# EAGLE design mikrofonverstärker (EAGLE 5.10)
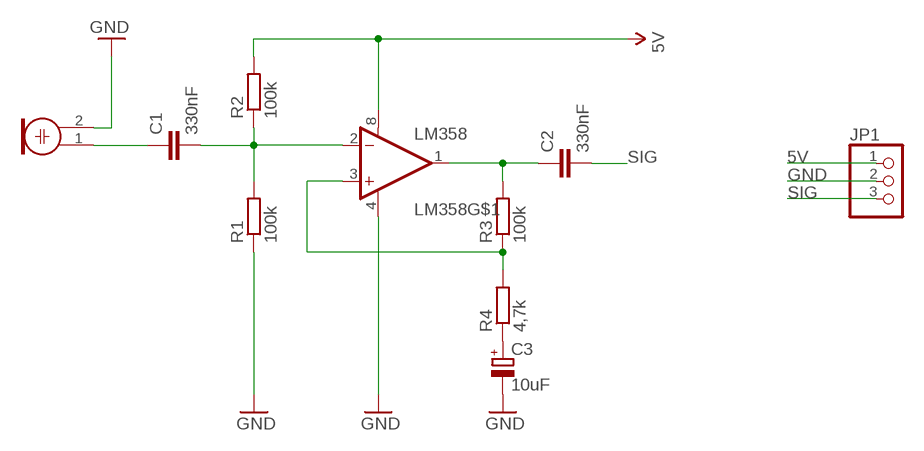
[diagram p0: schematic, sheet 1]

## Parts
C1  330nF  C-EUC0805  [C0805]
C2  330nF  C-EUC0805  [C0805]
C3  10uF  CPOL-EUE2,5-6E  [E2,5-6E]
JP1  PINHD-1X3/90  [1X03/90]
LM358  LM358  [DIP08]
M1  MIC  ELECTRET_MICROPHON-WM-63PR  [WM-63PR]
R1  100k  R-EU_R0805  [R0805]
R2  100k  R-EU_R0805  [R0805]
R3  100k  R-EU_R0805  [R0805]
R4  4,7k  R-EU_R0805  [R0805]

## Nets
5V: JP1.1 LM358.8(V+) R2.2
GND: C3.- JP1.2 LM358.4(V-) M1.2 R1.1
N$1: C2.1 LM358.1(OUT) R3.2
N$2: LM358.3(+IN) R3.1 R4.2
N$3: C1.2 LM358.2(-IN) R1.2 R2.1
N$4: C1.1 M1.1
N$5: C3.+ R4.1
SIG: C2.2 JP1.3
Unconnected: LM358.5(+IN) LM358.6(-IN) LM358.7(OUT)

## Library data of the parts
C1 C2 = rcl:C-EU: CAPACITOR, European symbol
C3 = rcl:CPOL-EU: POLARIZED CAPACITOR, European symbol
JP1 = pinhead:PINHD-1X3: PIN HEADER
LM358 = SparkFun:LM358
M1 = microphon:ELECTRET_MICROPHON-: Electret Condenser Microphone
R1-R4 = rcl:R-EU_: RESISTOR, European symbol

## Board
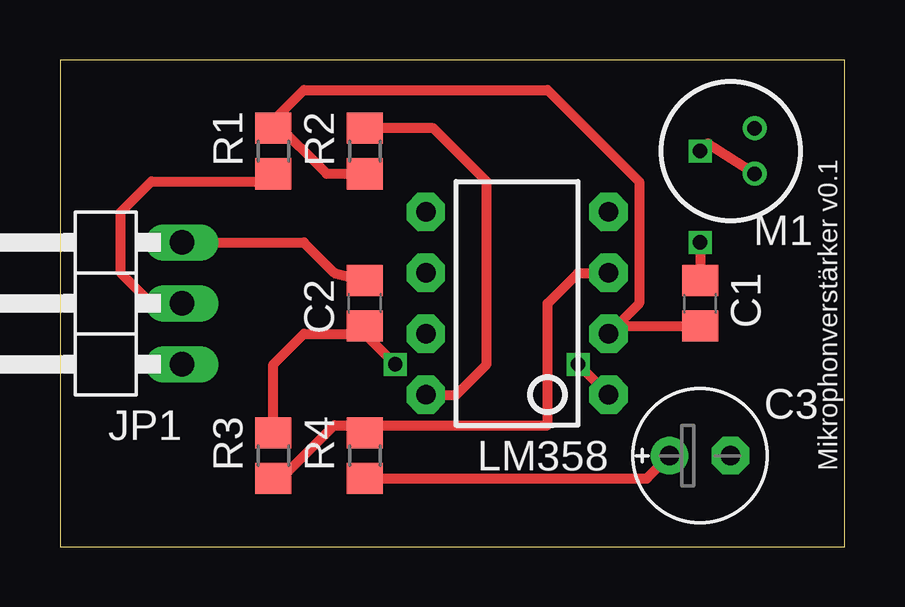
[diagram p1: board, top side]
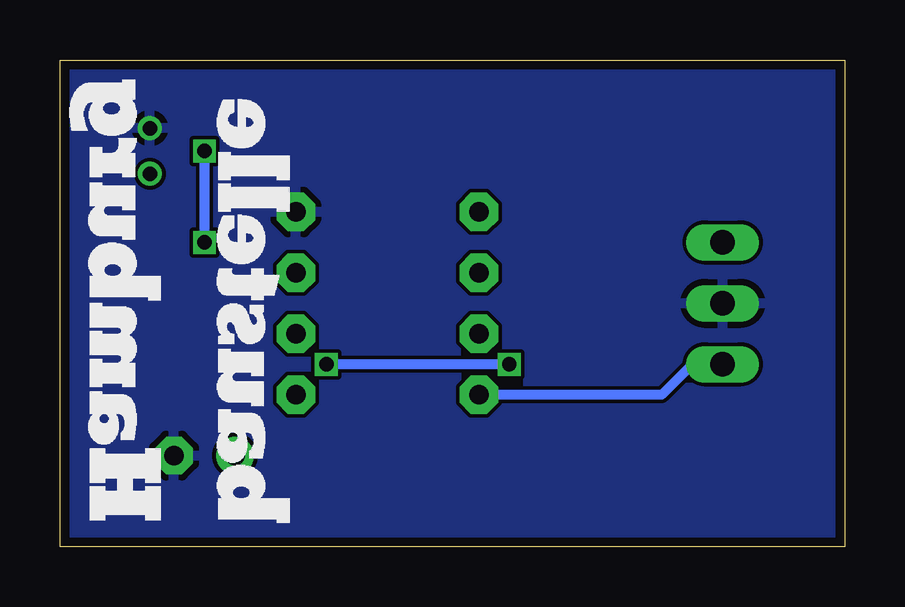
[diagram p2: board, bottom side, seen from below]

Size 32.69 x 20.31 mm. Coordinates in mm from the lower left corner, seen from the top.
Outline: 0,0 32.69,0 32.69,20.31 0,20.31 0,0
Copper layers (1*16): Top 0.0356mm / dielectric 1.5011mm / Bottom 0.0356mm
Design rules "LaenPCBOrder": minimum track width 6mil, minimum drill 13mil, track to track 6mil, track to pad 6mil, pad to pad 6mil, via to via 6mil, smd to smd 6mil, copper to edge 15mil, drill to drill 6mil, minimum pad ring 7mil, minimum via ring 7mil, stop-mask expansion 4mil, vias tented up to drill 0mil, thermal gap 10mil

### Footprints (pad centres in the part's own frame; a part is rotated, then mirrored left to right if it is on the bottom)
C0805 = smd 1.3 x 1.5: 1 -0.95,0; 2 0.95,0
E2,5-6E = drill 0.813 pad 1.575 round: + -1.27,0 | drill 0.813 pad 1.575 octagon: - 1.27,0
1X03/90 = drill 1.016 long: 1 -2.54,-3.81; 2 0,-3.81; 3 2.54,-3.81
DIP08 = drill 0.813 pad 1.6 octagon: 1 -3.81,-3.81; 2 -1.27,-3.81; 3 1.27,-3.81; 4 3.81,-3.81; 5 3.81,3.81; 6 1.27,3.81; 7 -1.27,3.81; 8 -3.81,3.81
WM-63PR = drill 0.6 pad 1 round: 1 -1,0.95; 2 -1,-0.95
R0805 = smd 1.3 x 1.5: 1 -0.95,0; 2 0.95,0

### Placement (x,y rotation side)
C1  26.67,10.16 270 top
C2  12.7,10.16 90 top
C3  26.67,3.81 0 top
JP1  1.27,10.16 90 top
LM358  19.05,10.16 90 top
M1  27.94,16.51 180 top
R1  8.89,16.51 90 top
R2  12.7,16.51 90 top
R3  8.89,3.81 90 top
R4  12.7,3.81 90 top

### Tracks (layer width: path | path; a pad name or v marks a point on that pad's centre or on a via)
5V
  Top 0.406: R2.2 15.56,17.46 17.78,15.24 17.78,7.62 16.51,6.35 LM358.8
  Bottom 0.406: JP1.1 6.35,7.62 7.62,6.35 LM358.8
GND
  Top 0.406: JP1.2 3.81,10.16 2.54,11.43 2.54,13.97 3.81,15.24 8.89,15.24 R1.1
  pour Bottom: 0,20.32 33.02,20.32 33.02,0 0,0
N$1  (via drill 0.6)
  Top 0.406: R3.2 8.89,7.62 10.16,8.89 12.38,8.89 C2.1 12.7,8.89 v13.97,7.62 | v21.59,7.62 LM358.1
  Bottom 0.406: v13.97,7.62 v21.59,7.62
N$2
  Top 0.406: LM358.3 21.59,11.43 20.32,10.16 20.32,5.08 13.02,5.08 R4.2 12.38,5.08 11.43,5.08 9.21,2.86 R3.1
N$3
  Top 0.152: R1.2 8.89,17.78
  Top 0.406: C1.2 23.18,9.21 LM358.2 24.13,10.16 24.13,15.24 20.32,19.05 10.16,19.05 8.89,17.78 11.11,15.56 R2.1
N$4  (via drill 0.6)
  Top 0.406: M1.1 26.99,16.83 v26.67,16.51 | v26.67,12.7 C1.1
  Bottom 0.406: v26.67,16.51 v26.67,12.7
N$5
  Top 0.406: R4.1 24.45,2.86 C3.+
SIG
  Top 0.406: C2.2 11.43,11.43 10.16,12.7 JP1.3

### Text on the board
tNames: Mikrophonverstärker v0.1